# Altium schematic sheet display.SchDoc
size A4; SheetNumber: 8; SheetTotal: 8
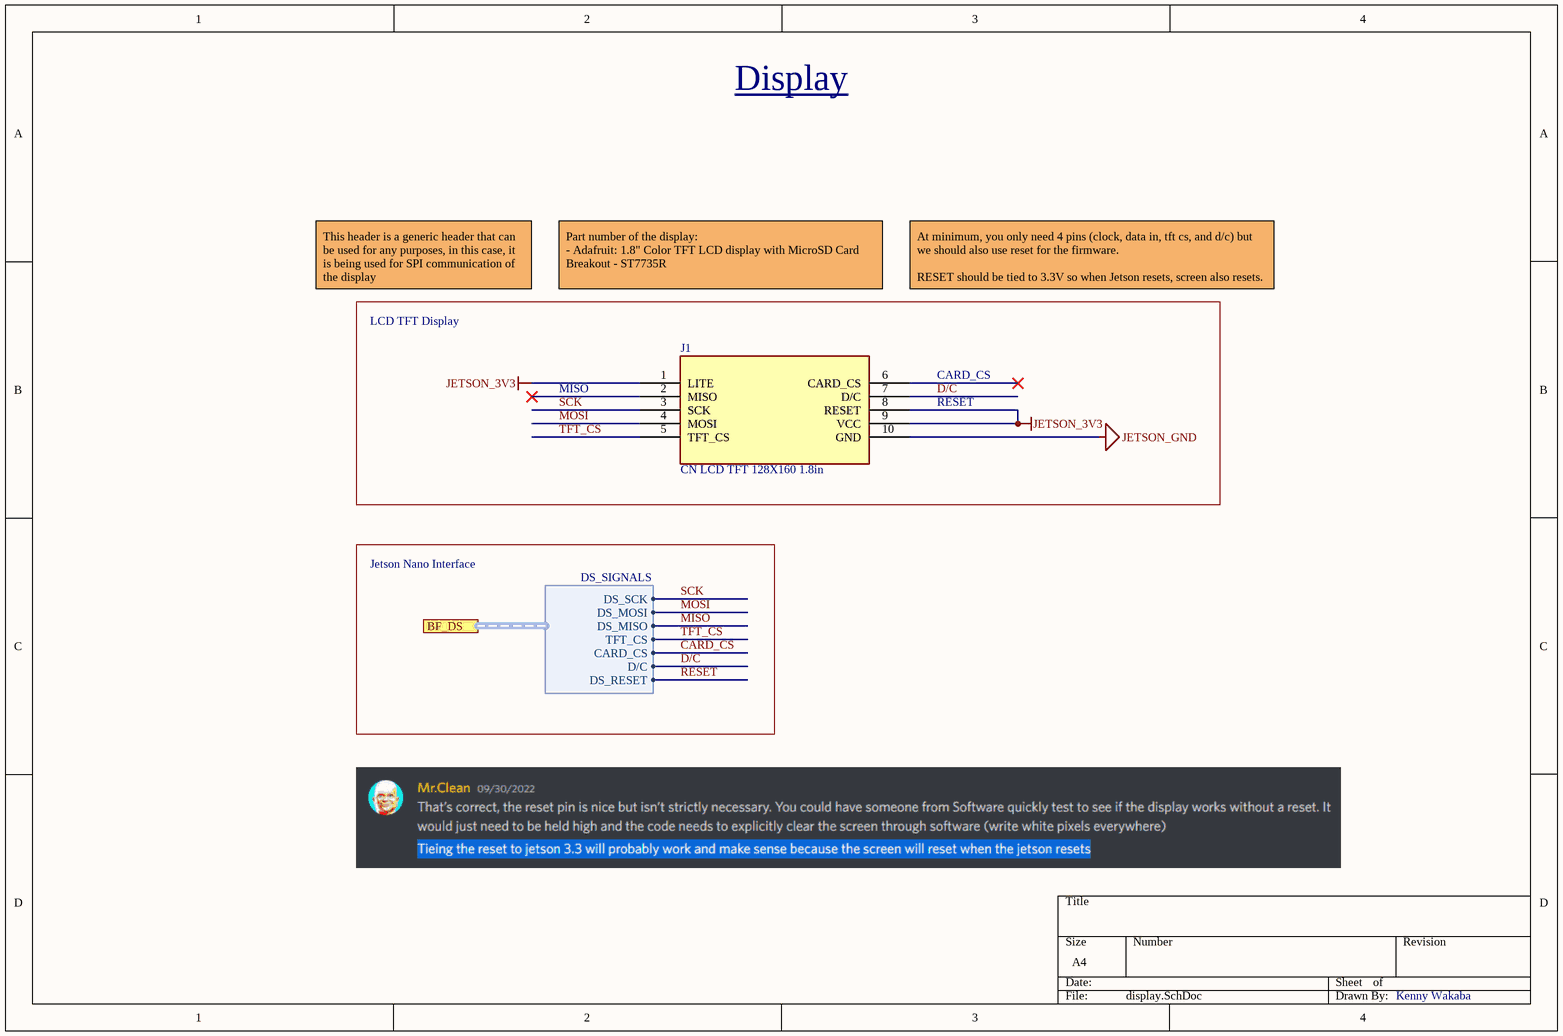
[diagram p0: display.SchDoc]

## Parts
J1  CN LCD TFT 128X160 1.8in  [CN LCD TFT 128X160 1.8in]

## Ports
BF_DS (harness DS_SIGNALS)

## Harnesses
DS_SIGNALS: DS_SCK, DS_MOSI, DS_MISO, TFT_CS, CARD_CS, D/C, DS_RESET

## Nets
JETSON_3V3: J1.1(LITE) J1.8(RESET) J1.9(VCC)
JETSON_GND: J1.10(GND)
CARD_CS: port BF_DS.CARD_CS
D/C: J1.7(D/C) ; port BF_DS.D/C
MISO: port BF_DS.DS_MISO
MOSI: J1.4(MOSI) ; port BF_DS.DS_MOSI
RESET: port BF_DS.DS_RESET
SCK: J1.3(SCK) ; port BF_DS.DS_SCK
TFT_CS: J1.5(TFT_CS) ; port BF_DS.TFT_CS

Not connected (* = marked no-connect by the designer): J1 2(MISO)* 6(CARD_CS)*

## Notes on the sheet
- Display
- This header is a generic header that can be used for any purposes, in this case, it is being used for SPI communication of the display
- Part number of the display:
  - Adafruit: 1.8" Color TFT LCD display with MicroSD Card Breakout - ST7735R
- At minimum, you only need 4 pins (clock, data in, tft cs, and d/c) but we should also use reset for the firmware.
  RESET should be tied to 3.3V so when Jetson resets, screen also resets.
- LCD TFT Display
- CARD_CS
- MISO
- RESET
- Jetson Nano Interface
- Kenny Wakaba

## Library data of the parts
J1 = CN LCD TFT 128X160 1.8in: Graphic LCD Display Module Transmissive Red, Green, Blue (RGB) TFT - Color SPI 1.8" (45.72mm) 128 x 160; Manufacturer Part Number 1: 358; Part Number: CN LCD TFT 128X160 1.8in; Supplier 1: Digi-Key; Supplier Part Number 1: 1528-1536-ND; Supplier URL 1: https://www.digikey.ca/en/products/detail/adafruit-industries-llc/358/5801368; Pin Count: 10